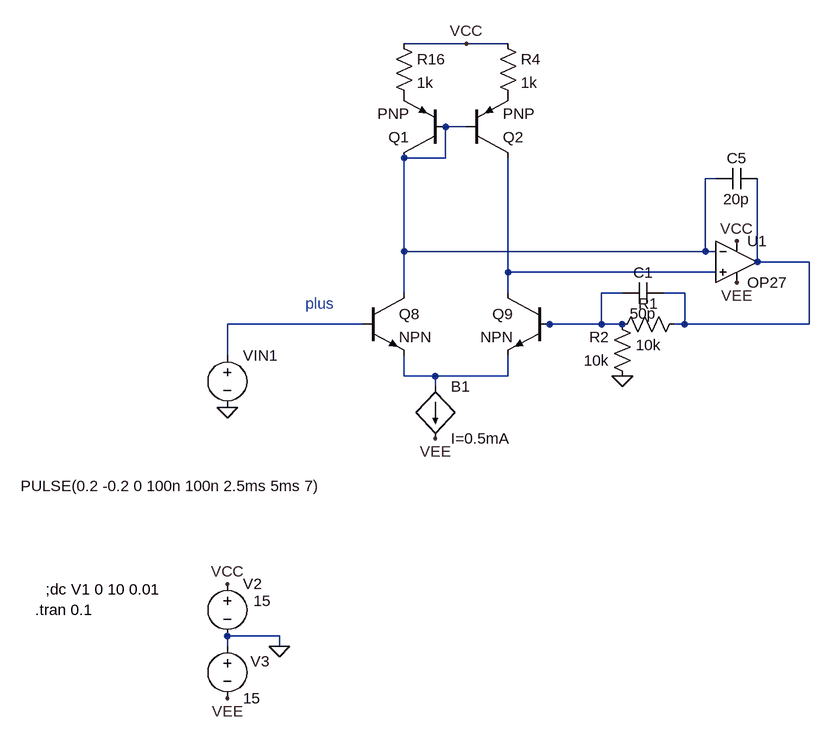
[diagram p0: schematic Draft39.asc]
Draft39.asc, the LTspice schematic file:
Version 4
SHEET 1 1648 868
WIRE -768 -608 -864 -608
WIRE -704 -608 -768 -608
WIRE -768 -480 -800 -480
WIRE -800 -432 -800 -480
WIRE -800 -432 -864 -432
WIRE -384 -400 -400 -400
WIRE -864 -288 -864 -432
WIRE -400 -288 -400 -400
WIRE -400 -288 -864 -288
WIRE -384 -288 -400 -288
WIRE -320 -272 -320 -400
WIRE -240 -272 -320 -272
WIRE -704 -256 -704 -432
WIRE -384 -256 -704 -256
WIRE -864 -224 -864 -288
WIRE -704 -224 -704 -256
WIRE -528 -224 -560 -224
WIRE -432 -224 -464 -224
WIRE -928 -176 -1136 -176
WIRE -640 -176 -656 -176
WIRE -560 -176 -560 -224
WIRE -560 -176 -640 -176
WIRE -528 -176 -560 -176
WIRE -432 -176 -432 -224
WIRE -432 -176 -448 -176
WIRE -240 -176 -240 -272
WIRE -240 -176 -432 -176
WIRE -1136 -128 -1136 -176
WIRE -864 -96 -864 -128
WIRE -816 -96 -864 -96
WIRE -704 -96 -704 -128
WIRE -704 -96 -816 -96
WIRE -816 -80 -816 -96
WIRE -1056 304 -1136 304
WIRE -1136 320 -1136 304
WIRE -1056 320 -1056 304
FLAG -1056 320 0
FLAG -1136 224 VCC
FLAG -1136 400 VEE
FLAG -1136 -48 0
FLAG -352 -304 VCC
FLAG -352 -240 VEE
FLAG -816 0 VEE
FLAG -528 -96 0
FLAG -768 -608 VCC
SYMBOL voltage -1136 208 R0
WINDOW 123 0 0 Left 0
WINDOW 39 0 0 Left 0
WINDOW 3 40 42 Left 2
SYMATTR Value 15
SYMATTR InstName V2
SYMBOL voltage -1136 304 R0
WINDOW 123 0 0 Left 0
WINDOW 39 0 0 Left 0
WINDOW 0 36 39 Left 2
SYMATTR InstName V3
SYMATTR Value 15
SYMBOL bi -816 -80 R0
SYMATTR InstName B1
SYMATTR Value I=0.5mA
SYMBOL res -880 -624 R0
SYMATTR InstName R16
SYMATTR Value 1k
SYMBOL npn -928 -224 R0
SYMATTR InstName Q8
SYMBOL npn -640 -224 M0
SYMATTR InstName Q9
SYMBOL voltage -1136 -144 R0
WINDOW 123 0 0 Left 0
WINDOW 39 0 0 Left 0
WINDOW 3 -318 217 Left 2
SYMATTR Value PULSE(0.2 -0.2 0 100n 100n 2.5ms 5ms 7)
SYMATTR InstName VIN1
SYMBOL cap -320 -416 R90
WINDOW 0 0 32 VBottom 2
WINDOW 3 32 32 VTop 2
SYMATTR InstName C5
SYMATTR Value 20p
SYMBOL res -432 -192 R90
WINDOW 0 0 56 VBottom 2
WINDOW 3 32 56 VTop 2
SYMATTR InstName R1
SYMATTR Value 10k
SYMBOL res -512 -80 R180
WINDOW 0 36 76 Left 2
WINDOW 3 36 40 Left 2
SYMATTR InstName R2
SYMATTR Value 10k
SYMBOL pnp -800 -432 R180
SYMATTR InstName Q1
SYMBOL pnp -768 -432 M180
SYMATTR InstName Q2
SYMBOL res -720 -624 R0
SYMATTR InstName R4
SYMATTR Value 1k
SYMBOL OpAmps\\OP27 -352 -336 R0
SYMATTR InstName U1
SYMBOL cap -464 -240 R90
WINDOW 0 0 32 VBottom 2
WINDOW 3 32 32 VTop 2
SYMATTR InstName C1
SYMATTR Value 50p
TEXT -1416 232 Left 2 !;dc V1 0 10 0.01
TEXT -1432 264 Left 2 !.tran 0.1
TEXT -1016 -208 Left 2 ;plus

The netlist it stands for:
* Draft39.asc
V2 VCC 0 15
V3 0 VEE 15
B1 N006 VEE I=0.5mA
R16 VCC P001 1k
Q8 N001 N005 N006 0 NPN
Q9 N003 N004 N006 0 NPN
VIN1 N005 0 PULSE(0.2 -0.2 0 100n 100n 2.5ms 5ms 7)
C5 N002 N001 20p
R1 N002 N004 10k
R2 0 N004 10k
Q1 N001 N001 P001 0 PNP
Q2 N003 N001 P002 0 PNP
R4 VCC P002 1k
XU1 N003 N001 VCC VEE N002 OP27  ; pins In+ In- V+ V- OUT
C1 N002 N004 50p
.model NPN NPN
.model PNP PNP
.lib standard.bjt
;dc V1 0 10 0.01
.tran 0.1
* plus
.lib ADI.lib
.backanno
.end